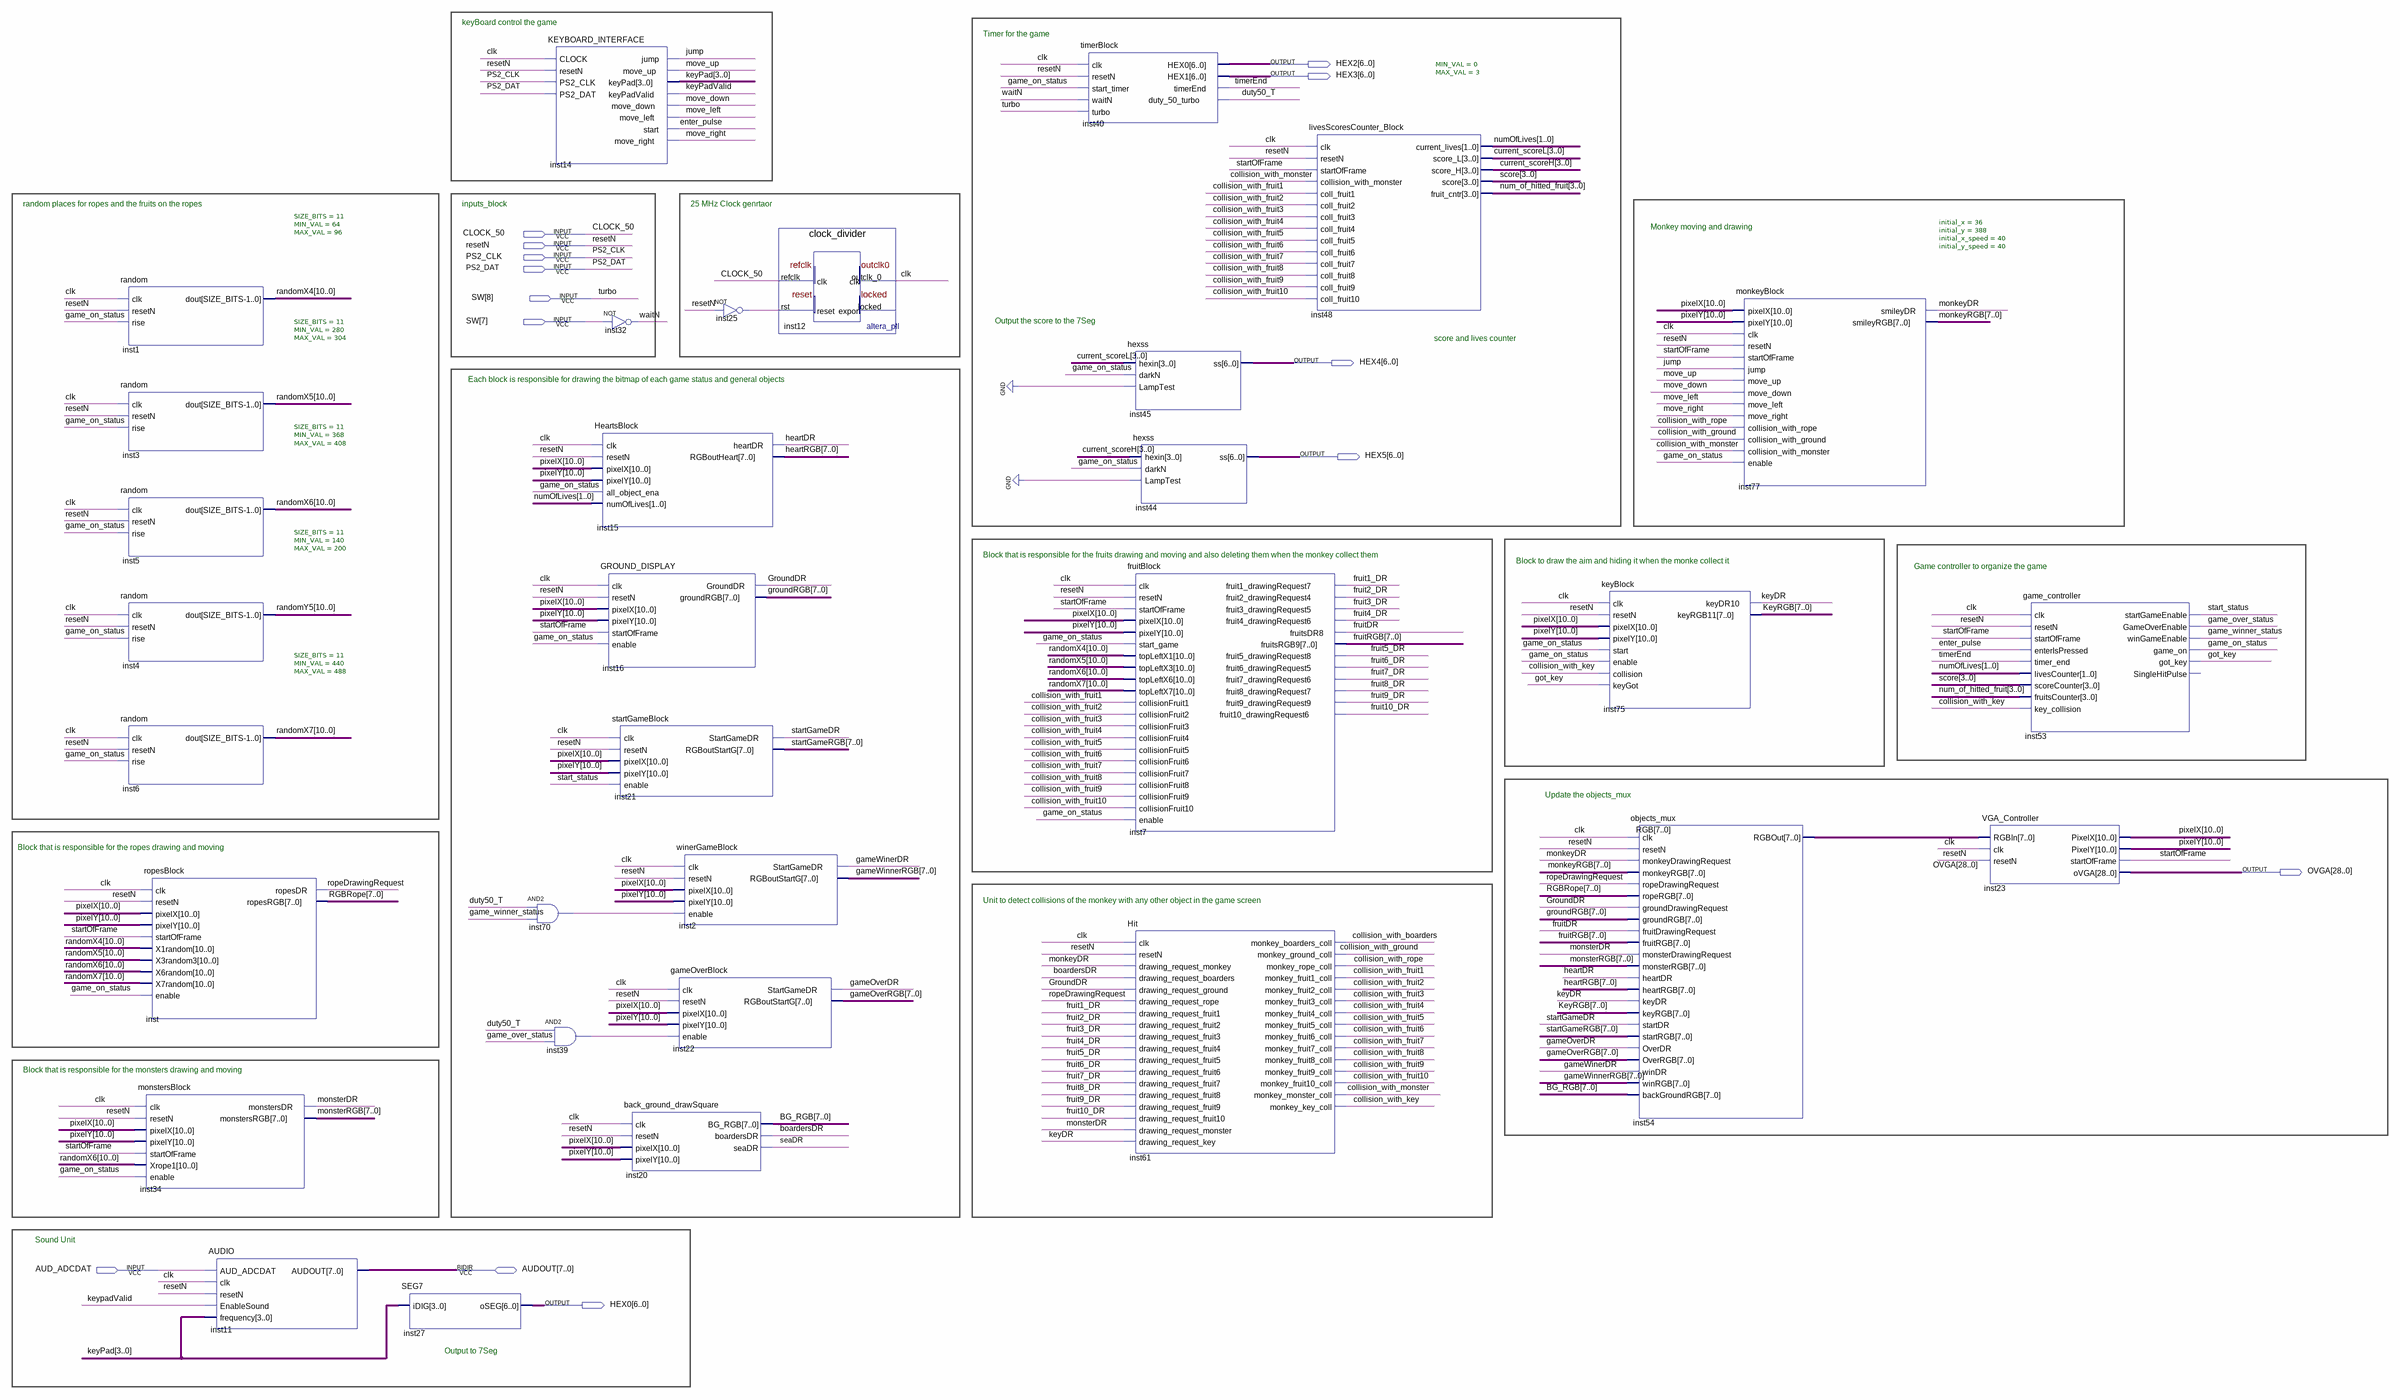
[diagram p0: schematic sheet]
// Quartus schematic TOP_VGA_MONKEY_KONG.bdf as structural Verilog: 32 symbols, 14 pins
module TOP_VGA_MONKEY_KONG (
  input  CLOCK_50,
  input  resetN,
  input  PS2_CLK,
  input  PS2_DAT,
  input  [8:7] SW,
  input  AUD_ADCDAT,
  inout  [7:0] AUDOUT,
  output [6:0] HEX2,
  output [6:0] HEX3,
  output [6:0] HEX4,
  output [6:0] HEX5,
  output [28:0] OVGA,
  output [6:0] HEX0
);

  wire boardersDR, clk, collision_with_boarders, collision_with_fruit1, collision_with_fruit2,
       collision_with_fruit3, collision_with_fruit4, collision_with_fruit5, collision_with_fruit6,
       collision_with_fruit7, collision_with_fruit8, collision_with_fruit9, collision_with_fruit10,
       collision_with_ground, collision_with_key, collision_with_monster, collision_with_rope, duty50_T,
       enter_pulse, fruit1_DR, fruit2_DR, fruit3_DR, fruit4_DR, fruit5_DR, fruit6_DR, fruit7_DR, fruit8_DR,
       fruit9_DR, fruit10_DR, fruitDR, game_on_status, game_over_status, game_winner_status, gameOverDR,
       gameWinerDR, got_key, GroundDR, heartDR, inst25_out, inst39_out, inst70_out, jump, keyDR, keypadValid,
       monkeyDR, monsterDR, move_down, move_left, move_right, move_up, ropeDrawingRequest, seaDR,
       start_status, startGameDR, startOfFrame, timerEnd, waitN;
  wire [1:0] numOfLives;
  wire [3:0] current_scoreH, current_scoreL, keyPad, num_of_hitted_fruit, score;
  wire [7:0] BG_RGB, fruitRGB, gameOverRGB, gameWinnerRGB, groundRGB, heartRGB, KeyRGB, monkeyRGB,
       monsterRGB, RGB, RGBRope, startGameRGB;
  wire [10:0] pixelX, pixelY, randomX4, randomX5, randomX6, randomX7, randomY5;

  random #(.SIZE_BITS(11), .MIN_VAL(64), .MAX_VAL(96)) inst1 (
    .clk(clk), .resetN(resetN), .rise(game_on_status), .dout(randomX4));
  random #(.SIZE_BITS(11), .MIN_VAL(280), .MAX_VAL(304)) inst3 (
    .clk(clk), .resetN(resetN), .rise(game_on_status), .dout(randomX5));
  random #(.SIZE_BITS(11), .MIN_VAL(368), .MAX_VAL(408)) inst5 (
    .clk(clk), .resetN(resetN), .rise(game_on_status), .dout(randomX6));
  random #(.SIZE_BITS(11), .MIN_VAL(140), .MAX_VAL(200)) inst4 (
    .clk(clk), .resetN(resetN), .rise(game_on_status), .dout(randomY5));
  random #(.SIZE_BITS(11), .MIN_VAL(440), .MAX_VAL(488)) inst6 (
    .clk(clk), .resetN(resetN), .rise(game_on_status), .dout(randomX7));
  ropesBlock inst (
    .clk(clk), .resetN(resetN), .pixelX(pixelX), .pixelY(pixelY), .startOfFrame(startOfFrame),
    .X1random(randomX4), .X3random3(randomX5), .X6random(randomX6), .X7random(randomX7),
    .enable(game_on_status), .ropesDR(ropeDrawingRequest), .ropesRGB(RGBRope));
  monstersBlock inst34 (
    .clk(clk), .resetN(resetN), .pixelX(pixelX), .pixelY(pixelY), .startOfFrame(startOfFrame),
    .Xrope1(randomX6), .enable(game_on_status), .monstersDR(monsterDR), .monstersRGB(monsterRGB));
  AUDIO inst11 (
    .AUD_ADCDAT(AUD_ADCDAT), .clk(clk), .resetN(resetN), .EnableSound(keypadValid), .frequency(keyPad),
    .AUDOUT(AUDOUT));
  SEG7 inst27 (.iDIG(keyPad), .oSEG(HEX0));
  and inst70 (inst70_out, duty50_T, game_winner_status);
  KEYBOARD_INTERFACE inst14 (
    .CLOCK(clk), .resetN(resetN), .PS2_CLK(PS2_CLK), .PS2_DAT(PS2_DAT), .jump(jump), .move_up(move_up),
    .keyPad(keyPad), .keyPadValid(keypadValid), .move_down(move_down), .move_left(move_left),
    .start(enter_pulse), .move_right(move_right));
  and inst39 (inst39_out, duty50_T, game_over_status);
  not inst32 (waitN, SW[7]);
  HeartsBlock inst15 (
    .clk(clk), .resetN(resetN), .pixelX(pixelX), .pixelY(pixelY), .all_object_ena(game_on_status),
    .numOfLives(numOfLives), .heartDR(heartDR), .RGBoutHeart(heartRGB));
  GROUND_DISPLAY inst16 (
    .clk(clk), .resetN(resetN), .pixelX(pixelX), .pixelY(pixelY), .startOfFrame(startOfFrame),
    .enable(game_on_status), .GroundDR(GroundDR), .groundRGB(groundRGB));
  startGameBlock inst21 (
    .clk(clk), .resetN(resetN), .pixelX(pixelX), .pixelY(pixelY), .enable(start_status),
    .StartGameDR(startGameDR), .RGBoutStartG(startGameRGB));
  back_ground_drawSquare inst20 (
    .clk(clk), .resetN(resetN), .pixelX(pixelX), .pixelY(pixelY), .BG_RGB(BG_RGB), .boardersDR(boardersDR),
    .seaDR(seaDR));
  gameOverBlock inst22 (
    .clk(clk), .resetN(resetN), .pixelX(pixelX), .pixelY(pixelY), .enable(inst39_out),
    .StartGameDR(gameOverDR), .RGBoutStartG(gameOverRGB));
  not inst25 (inst25_out, resetN);
  winerGameBlock inst2 (
    .clk(clk), .resetN(resetN), .pixelX(pixelX), .pixelY(pixelY), .enable(inst70_out),
    .StartGameDR(gameWinerDR), .RGBoutStartG(gameWinnerRGB));
  clock_divider inst12 (.refclk(CLOCK_50), .rst(inst25_out), .outclk_0(clk));  // open: locked
  timerBlock inst40 (
    .clk(clk), .resetN(resetN), .start_timer(game_on_status), .waitN(waitN), .turbo(SW[8]), .HEX0(HEX2),
    .HEX1(HEX3), .timerEnd(timerEnd), .duty_50_turbo(duty50_T));
  hexss inst45 (.hexin(current_scoreL), .darkN(game_on_status), .LampTest(1'b0), .ss(HEX4));
  hexss inst44 (.hexin(current_scoreH), .darkN(game_on_status), .LampTest(1'b0), .ss(HEX5));
  fruitBlock inst7 (
    .clk(clk), .resetN(resetN), .startOfFrame(startOfFrame), .pixelX(pixelX), .pixelY(pixelY),
    .start_game(game_on_status), .topLeftX1(randomX4), .topLeftX3(randomX5), .topLeftX6(randomX6),
    .topLeftX7(randomX7), .collisionFruit1(collision_with_fruit1), .collisionFruit2(collision_with_fruit2),
    .collisionFruit3(collision_with_fruit3), .collisionFruit4(collision_with_fruit4),
    .collisionFruit5(collision_with_fruit5), .collisionFruit6(collision_with_fruit6),
    .collisionFruit7(collision_with_fruit7), .collisionFruit8(collision_with_fruit8),
    .collisionFruit9(collision_with_fruit9), .collisionFruit10(collision_with_fruit10),
    .enable(game_on_status), .fruit1_drawingRequest7(fruit1_DR), .fruit2_drawingRequest4(fruit2_DR),
    .fruit3_drawingRequest5(fruit3_DR), .fruit4_drawingRequest6(fruit4_DR), .fruitsDR8(fruitDR),
    .fruitsRGB9(fruitRGB), .fruit5_drawingRequest8(fruit5_DR), .fruit6_drawingRequest5(fruit6_DR),
    .fruit7_drawingRequest6(fruit7_DR), .fruit8_drawingRequest7(fruit8_DR),
    .fruit9_drawingRequest9(fruit9_DR), .fruit10_drawingRequest6(fruit10_DR));
  Hit inst61 (
    .clk(clk), .resetN(resetN), .drawing_request_monkey(monkeyDR), .drawing_request_boarders(boardersDR),
    .drawing_request_ground(GroundDR), .drawing_request_rope(ropeDrawingRequest),
    .drawing_request_fruit1(fruit1_DR), .drawing_request_fruit2(fruit2_DR),
    .drawing_request_fruit3(fruit3_DR), .drawing_request_fruit4(fruit4_DR),
    .drawing_request_fruit5(fruit5_DR), .drawing_request_fruit6(fruit6_DR),
    .drawing_request_fruit7(fruit7_DR), .drawing_request_fruit8(fruit8_DR),
    .drawing_request_fruit9(fruit9_DR), .drawing_request_fruit10(fruit10_DR),
    .drawing_request_monster(monsterDR), .drawing_request_key(keyDR),
    .monkey_boarders_coll(collision_with_boarders), .monkey_ground_coll(collision_with_ground),
    .monkey_rope_coll(collision_with_rope), .monkey_fruit1_coll(collision_with_fruit1),
    .monkey_fruit2_coll(collision_with_fruit2), .monkey_fruit3_coll(collision_with_fruit3),
    .monkey_fruit4_coll(collision_with_fruit4), .monkey_fruit5_coll(collision_with_fruit5),
    .monkey_fruit6_coll(collision_with_fruit6), .monkey_fruit7_coll(collision_with_fruit7),
    .monkey_fruit8_coll(collision_with_fruit8), .monkey_fruit9_coll(collision_with_fruit9),
    .monkey_fruit10_coll(collision_with_fruit10), .monkey_monster_coll(collision_with_monster),
    .monkey_key_coll(collision_with_key));
  livesScoresCounter_Block #(.MIN_VAL(0), .MAX_VAL(3)) inst48 (
    .clk(clk), .resetN(resetN), .startOfFrame(startOfFrame), .collision_with_monster(collision_with_monster),
    .coll_fruit1(collision_with_fruit1), .coll_fruit2(collision_with_fruit2),
    .coll_fruit3(collision_with_fruit3), .coll_fruit4(collision_with_fruit4),
    .coll_fruit5(collision_with_fruit5), .coll_fruit6(collision_with_fruit6),
    .coll_fruit7(collision_with_fruit7), .coll_fruit8(collision_with_fruit8),
    .coll_fruit9(collision_with_fruit9), .coll_fruit10(collision_with_fruit10), .current_lives(numOfLives),
    .score_L(current_scoreL), .score_H(current_scoreH), .score(score), .fruit_cntr(num_of_hitted_fruit));
  keyBlock inst75 (
    .clk(clk), .resetN(resetN), .pixelX(pixelX), .pixelY(pixelY), .start(game_on_status),
    .enable(game_on_status), .collision(collision_with_key), .keyGot(got_key), .keyDR10(keyDR),
    .keyRGB11(KeyRGB));
  objects_mux inst54 (
    .clk(clk), .resetN(resetN), .monkeyDrawingRequest(monkeyDR), .monkeyRGB(monkeyRGB),
    .ropeDrawingRequest(ropeDrawingRequest), .ropeRGB(RGBRope), .groundDrawingRequest(GroundDR),
    .groundRGB(groundRGB), .fruitDrawingRequest(fruitDR), .fruitRGB(fruitRGB),
    .monsterDrawingRequest(monsterDR), .monsterRGB(monsterRGB), .heartDR(heartDR), .heartRGB(heartRGB),
    .keyDR(keyDR), .keyRGB(KeyRGB), .startDR(startGameDR), .startRGB(startGameRGB), .OverDR(gameOverDR),
    .OverRGB(gameOverRGB), .winDR(gameWinerDR), .winRGB(gameWinnerRGB), .backGroundRGB(BG_RGB), .RGBOut(RGB));
  monkeyBlock #(.initial_x(36), .initial_y(388), .initial_x_speed(40), .initial_y_speed(40)) inst77 (
    .pixelX(pixelX), .pixelY(pixelY), .clk(clk), .resetN(resetN), .startOfFrame(startOfFrame), .jump(jump),
    .move_up(move_up), .move_down(move_down), .move_left(move_left), .move_right(move_right),
    .collision_with_rope(collision_with_rope), .collision_with_ground(collision_with_ground),
    .collision_with_monster(collision_with_monster), .enable(game_on_status), .smileyDR(monkeyDR),
    .smileyRGB(monkeyRGB));
  VGA_Controller inst23 (
    .RGBIn(RGB), .clk(clk), .resetN(resetN), .PixelX(pixelX), .PixelY(pixelY), .startOfFrame(startOfFrame),
    .oVGA(OVGA));
  game_controller inst53 (
    .clk(clk), .resetN(resetN), .startOfFrame(startOfFrame), .enterIsPressed(enter_pulse),
    .timer_end(timerEnd), .livesCounter(numOfLives), .scoreCounter(score),
    .fruitsCounter(num_of_hitted_fruit), .key_collision(collision_with_key), .startGameEnable(start_status),
    .GameOverEnable(game_over_status), .winGameEnable(game_winner_status), .game_on(game_on_status),
    .got_key(got_key));  // open: SingleHitPulse

  // Other names for the same wires on the sheet: turbo = SW[8]

  // Notes on the sheet:
  //   keyBoard control the game
  //   Timer for the game
  //   random places for ropes and the fruits on the ropes
  //   inputs_block
  //   25 MHz Clock genrtaor
  //   Monkey moving and drawing
  //   Output the score to the 7Seg
  //   score and lives counter
  //   Each block is responsible for drawing the bitmap of each game status and general objects
  //   Block that is responsible for the fruits drawing and moving and also deleting them when the monkey collect them
  //   Block to draw the aim and hiding it when the monke collect it
  //   Game controller to organize the game 
  //   Update the objects_mux
  //   Block that is responsible for the ropes drawing and moving
  //   Unit to detect collisions of the monkey with any other object in the game screen
  //   Block that is responsible for the monsters drawing and moving
  //   Sound Unit
  //   Output to 7Seg
endmodule
